# EAGLE schematic ImageProc_2.5 (EAGLE 6.2)
AUTHOR: Ryan Julian (ryanjulian@berkeley.edu); REVISION: A; YEAR: 2012

## Sheet 1 of 5: Power
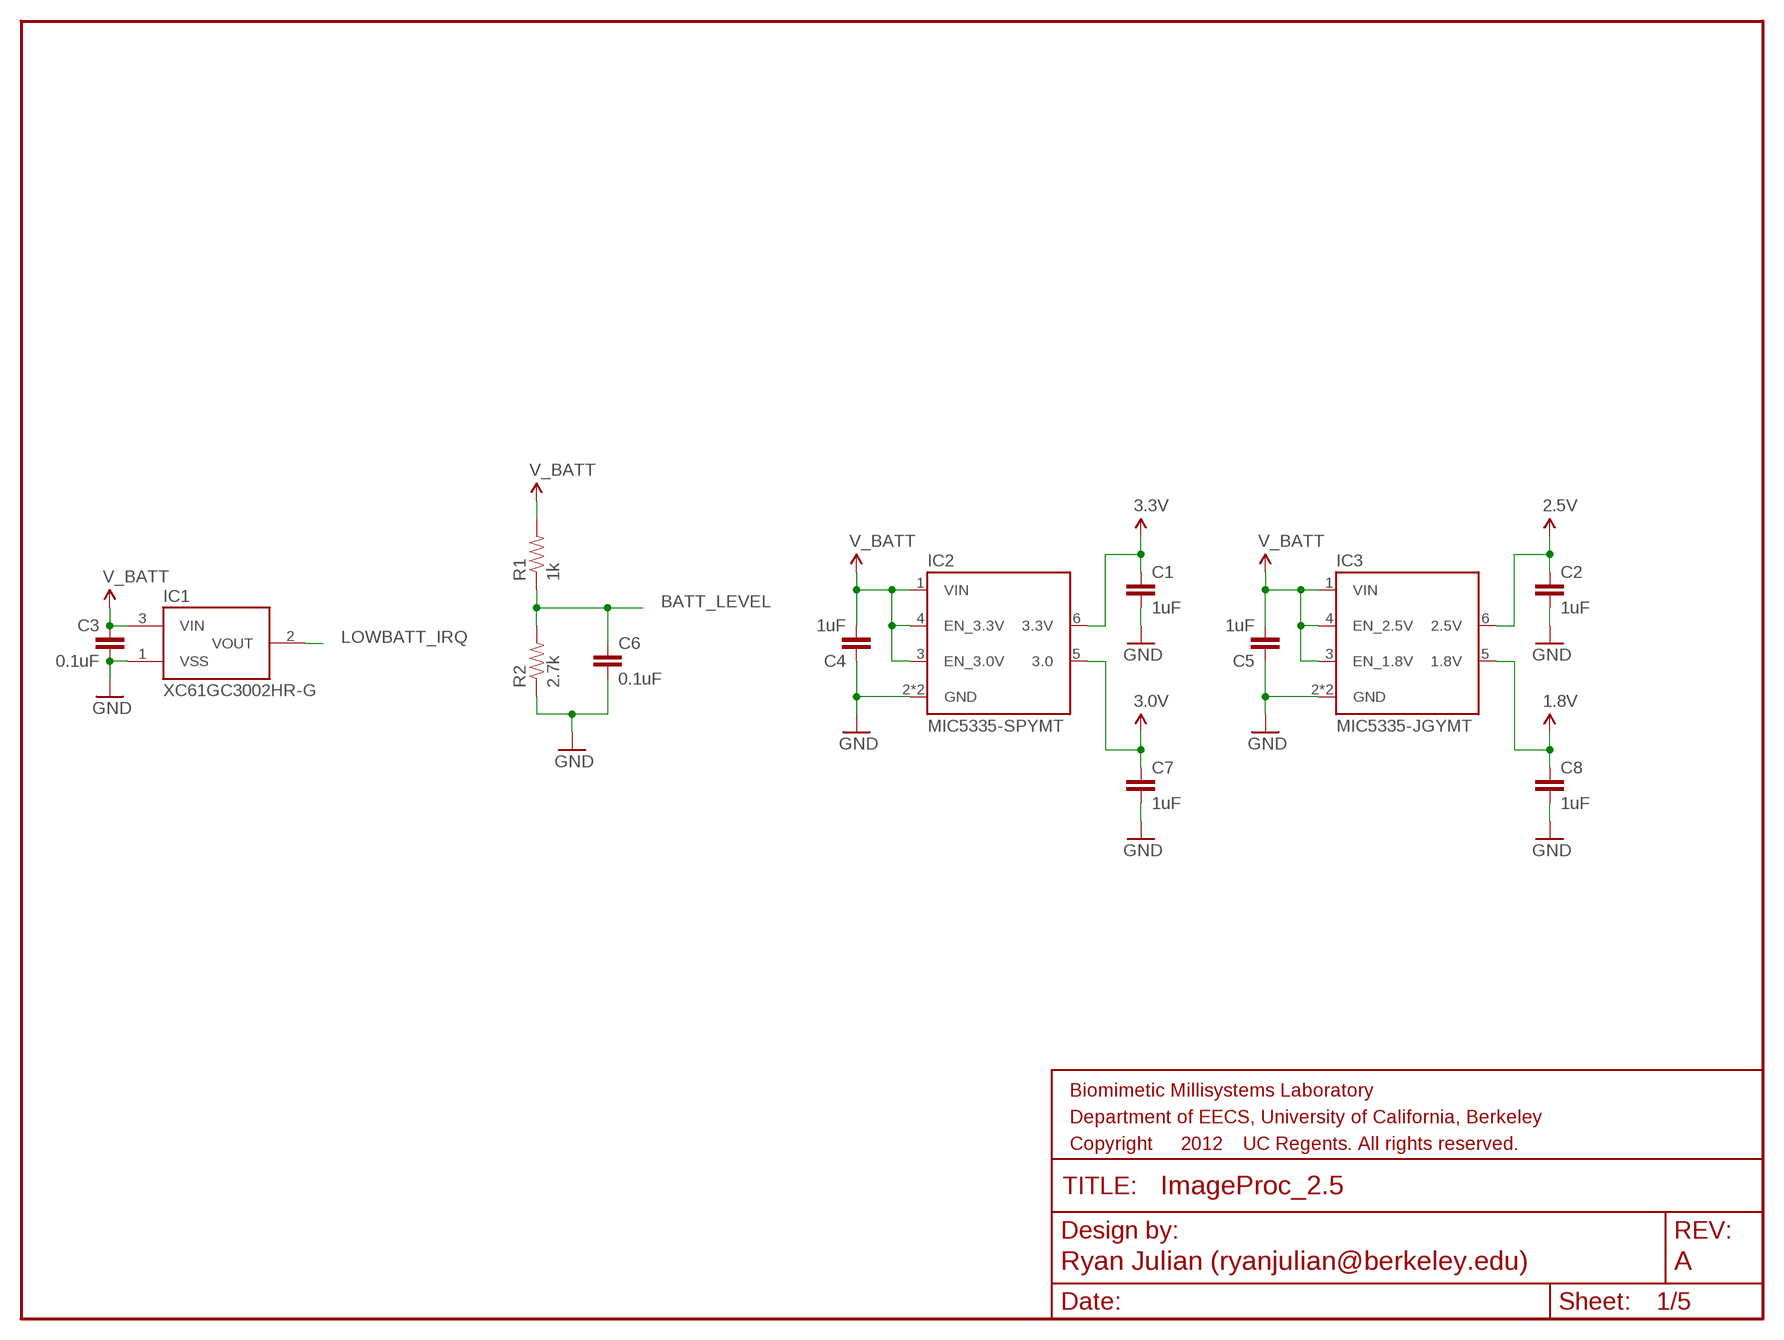
[diagram p0: schematic, sheet 1]
FRAME6 (FRAME-LETTER): YEAR: 2012

### Parts
C1  1uF  CAP0402-CAP  [0402-CAP]
C2  1uF  CAP0402-CAP  [0402-CAP]
C3  0.1uF  CAP0402-CAP  [0402-CAP]
C4  1uF  CAP0402-CAP  [0402-CAP]
C5  1uF  CAP0402-CAP  [0402-CAP]
C6  0.1uF  CAP0402-CAP  [0402-CAP]
C7  1uF  CAP0402-CAP  [0402-CAP]
C8  1uF  CAP0402-CAP  [0402-CAP]
IC1  XC61GC3002HR-G  [USP-3]
IC2  MIC5335-SPYMT  [MLF-6]
IC3  MIC5335-JGYMT  [MLF-6]
R1  1k  RESISTOR0402-RES  [0402-RES]
R2  2.7k  RESISTOR0402-RES  [0402-RES]

### Nets
1.8V: C8.1 IC3.5(1.8V) ; also sheet 5
2.5V: C2.1 IC3.6(2.5V) ; also sheet 5
3.0V: C7.1 IC2.5(3.0)
3.3V: C1.1 IC2.6(3.3V) ; also sheet 2,3,4,5
BATT_LEVEL: C6.1 R1.1 R2.2 ; also sheet 2
GND: C1.2 C2.2 C3.2 C4.1 C5.1 C6.2 C7.2 C8.2 IC1.1(VSS) IC2.2(GND) IC2.EPAD(GND) IC3.2(GND) IC3.EPAD(GND) R2.1 ; also sheet 2,3,4,5
LOWBATT_IRQ: IC1.2(VOUT) ; also sheet 2
V_BATT: C3.1 C4.2 C5.2 IC1.3(VIN) IC2.1(VIN) IC2.3(EN_3.0V) IC2.4(EN_3.3V) IC3.1(VIN) IC3.3(EN_1.8V) IC3.4(EN_2.5V) R1.2 ; also sheet 4,5

## Sheet 2 of 5: Microcontroller
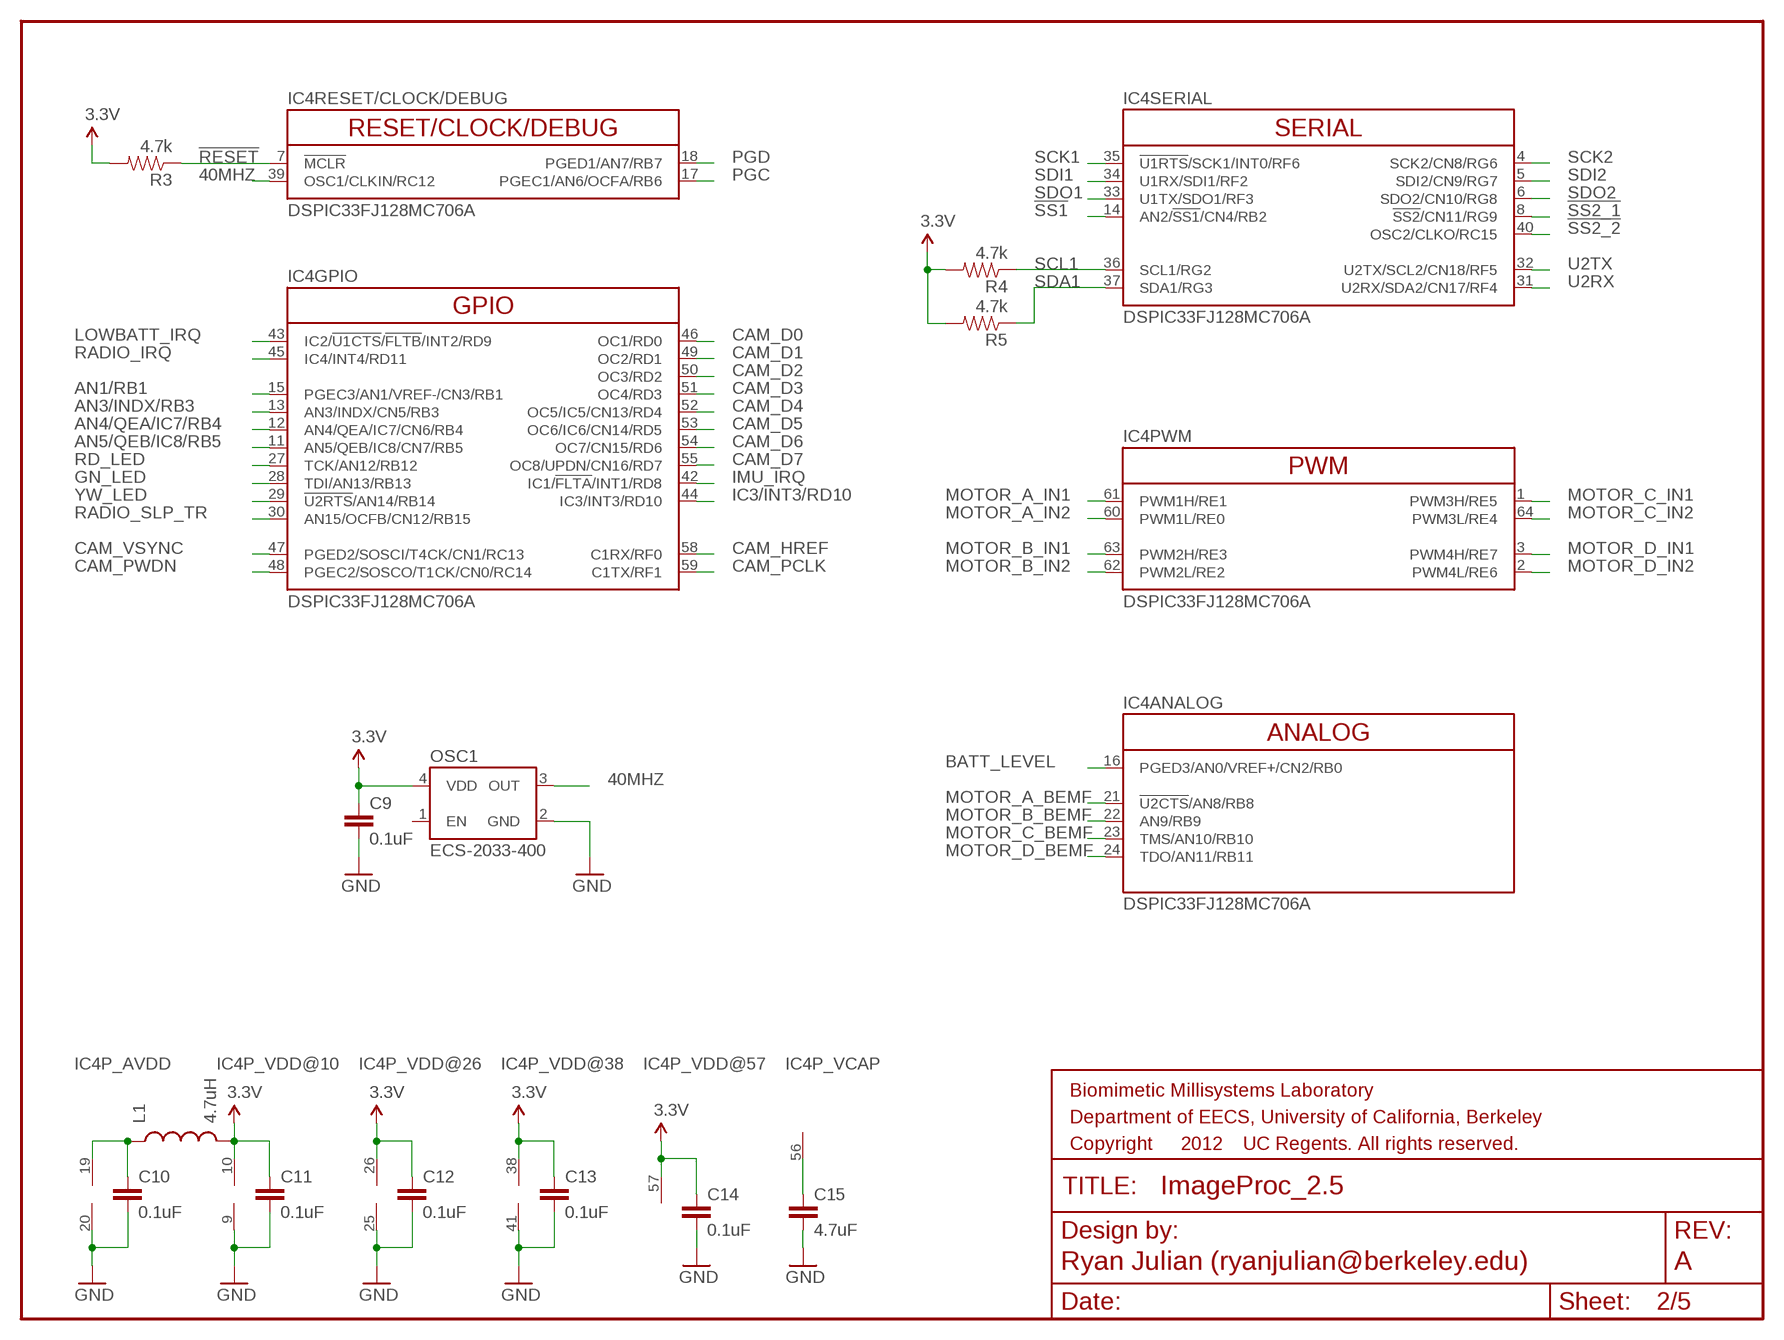
[diagram p1: schematic, sheet 2]

### Parts
C9  0.1uF  CAP0402-CAP  [0402-CAP]
C10  0.1uF  CAP0402-CAP  [0402-CAP]
C11  0.1uF  CAP0402-CAP  [0402-CAP]
C12  0.1uF  CAP0402-CAP  [0402-CAP]
C13  0.1uF  CAP0402-CAP  [0402-CAP]
C14  0.1uF  CAP0402-CAP  [0402-CAP]
C15  4.7uF  CAP0603-CAP  [0603-CAP]
IC4  DSPIC33FJ128MC706A  [TQFP-64]
L1  4.7uH  INDUCTOR0603  [0603]
OSC1  ECS-2033-400  [OSCILLATOR-SMD]
R3  4.7k  RESISTOR0402-RES  [0402-RES]
R4  4.7k  RESISTOR0402-RES  [0402-RES]
R5  4.7k  RESISTOR0402-RES  [0402-RES]

### Nets
3.3V: C9.1 C11.1 C12.1 C13.1 C14.1 IC4.10(P_VDD@10:V+) IC4.26(P_VDD@26:V+) IC4.38(P_VDD@38:V+) IC4.57(P_VDD@57:V+) L1.2 OSC1.4(VDD) R3.2 R4.2 R5.2 ; also sheet 1,3,4,5
40MHZ: IC4.39(RESET/CLOCK/DEBUG:OSC1/CLKIN/RC12) OSC1.3(OUT) ; also sheet 5
!RESET: IC4.7(RESET/CLOCK/DEBUG:!MCLR) R3.1 ; also sheet 3,5
!SS1: IC4.14(SERIAL:AN2/!SS1!/CN4/RB2) ; also sheet 3
!SS2_1: IC4.8(SERIAL:!SS2!/CN11/RG9) ; also sheet 5
!SS2_2: IC4.40(SERIAL:OSC2/CLKO/RC15) ; also sheet 5
AN1/RB1: IC4.15(GPIO:PGEC3/AN1/VREF-/CN3/RB1) ; also sheet 5
AN3/INDX/RB3: IC4.13(GPIO:AN3/INDX/CN5/RB3) ; also sheet 5
AN4/QEA/IC7/RB4: IC4.12(GPIO:AN4/QEA/IC7/CN6/RB4) ; also sheet 5
AN5/QEB/IC8/RB5: IC4.11(GPIO:AN5/QEB/IC8/CN7/RB5) ; also sheet 5
BATT_LEVEL: IC4.16(ANALOG:PGED3/AN0/VREF+/CN2/RB0) ; also sheet 1
CAM_D0: IC4.46(GPIO:OC1/RD0) ; also sheet 5
CAM_D1: IC4.49(GPIO:OC2/RD1) ; also sheet 5
CAM_D2: IC4.50(GPIO:OC3/RD2) ; also sheet 5
CAM_D3: IC4.51(GPIO:OC4/RD3) ; also sheet 5
CAM_D4: IC4.52(GPIO:OC5/IC5/CN13/RD4) ; also sheet 5
CAM_D5: IC4.53(GPIO:OC6/IC6/CN14/RD5) ; also sheet 5
CAM_D6: IC4.54(GPIO:OC7/CN15/RD6) ; also sheet 5
CAM_D7: IC4.55(GPIO:OC8/UPDN/CN16/RD7) ; also sheet 5
CAM_HREF: IC4.58(GPIO:C1RX/RF0) ; also sheet 5
CAM_PCLK: IC4.59(GPIO:C1TX/RF1) ; also sheet 5
CAM_PWDN: IC4.48(GPIO:PGEC2/SOSCO/T1CK/CN0/RC14) ; also sheet 5
CAM_VSYNC: IC4.47(GPIO:PGED2/SOSCI/T4CK/CN1/RC13) ; also sheet 5
GN_LED: IC4.28(GPIO:TDI/AN13/RB13) ; also sheet 5
GND: C9.2 C10.2 C11.2 C12.2 C13.2 C14.2 C15.2 IC4.9(P_VDD@10:V-) IC4.20(P_AVDD:V-) IC4.25(P_VDD@26:V-) IC4.41(P_VDD@38:V-) OSC1.2(GND) ; also sheet 1,3,4,5
IC3/INT3/RD10: IC4.44(GPIO:IC3/INT3/RD10) ; also sheet 5
IMU_IRQ: IC4.42(GPIO:IC1/!FLTA!/INT1/RD8) ; also sheet 5
LOWBATT_IRQ: IC4.43(GPIO:IC2/!U1CTS!/!FLTB!/INT2/RD9) ; also sheet 1
MOTOR_A_BEMF: IC4.21(ANALOG:!U2CTS!/AN8/RB8) ; also sheet 4
MOTOR_A_IN1: IC4.61(PWM:PWM1H/RE1) ; also sheet 4
MOTOR_A_IN2: IC4.60(PWM:PWM1L/RE0) ; also sheet 4
MOTOR_B_BEMF: IC4.22(ANALOG:AN9/RB9) ; also sheet 4
MOTOR_B_IN1: IC4.63(PWM:PWM2H/RE3) ; also sheet 4
MOTOR_B_IN2: IC4.62(PWM:PWM2L/RE2) ; also sheet 4
MOTOR_C_BEMF: IC4.23(ANALOG:TMS/AN10/RB10) ; also sheet 4
MOTOR_C_IN1: IC4.1(PWM:PWM3H/RE5) ; also sheet 4
MOTOR_C_IN2: IC4.64(PWM:PWM3L/RE4) ; also sheet 4
MOTOR_D_BEMF: IC4.24(ANALOG:TDO/AN11/RB11) ; also sheet 4
MOTOR_D_IN1: IC4.3(PWM:PWM4H/RE7) ; also sheet 4
MOTOR_D_IN2: IC4.2(PWM:PWM4L/RE6) ; also sheet 4
N$21: C10.1 IC4.19(P_AVDD:V+) L1.1
N$28: C15.1 IC4.56(P_VCAP:V+)
PGC: IC4.17(RESET/CLOCK/DEBUG:PGEC1/AN6/OCFA/RB6) ; also sheet 5
PGD: IC4.18(RESET/CLOCK/DEBUG:PGED1/AN7/RB7) ; also sheet 5
RADIO_IRQ: IC4.45(GPIO:IC4/INT4/RD11) ; also sheet 3
RADIO_SLP_TR: IC4.30(GPIO:AN15/OCFB/CN12/RB15) ; also sheet 3
RD_LED: IC4.27(GPIO:TCK/AN12/RB12) ; also sheet 5
SCK1: IC4.35(SERIAL:!U1RTS!/SCK1/INT0/RF6) ; also sheet 3
SCK2: IC4.4(SERIAL:SCK2/CN8/RG6) ; also sheet 5
SCL1: IC4.36(SERIAL:SCL1/RG2) R4.1 ; also sheet 5
SDA1: IC4.37(SERIAL:SDA1/RG3) R5.1 ; also sheet 5
SDI1: IC4.34(SERIAL:U1RX/SDI1/RF2) ; also sheet 3
SDI2: IC4.5(SERIAL:SDI2/CN9/RG7) ; also sheet 5
SDO1: IC4.33(SERIAL:U1TX/SDO1/RF3) ; also sheet 3
SDO2: IC4.6(SERIAL:SDO2/CN10/RG8) ; also sheet 5
U2RX: IC4.31(SERIAL:U2RX/SDA2/CN17/RF4) ; also sheet 5
U2TX: IC4.32(SERIAL:U2TX/SCL2/CN18/RF5) ; also sheet 5
YW_LED: IC4.29(GPIO:!U2RTS!/AN14/RB14) ; also sheet 5
Unconnected: OSC1.1(EN)

## Sheet 3 of 5: Radio
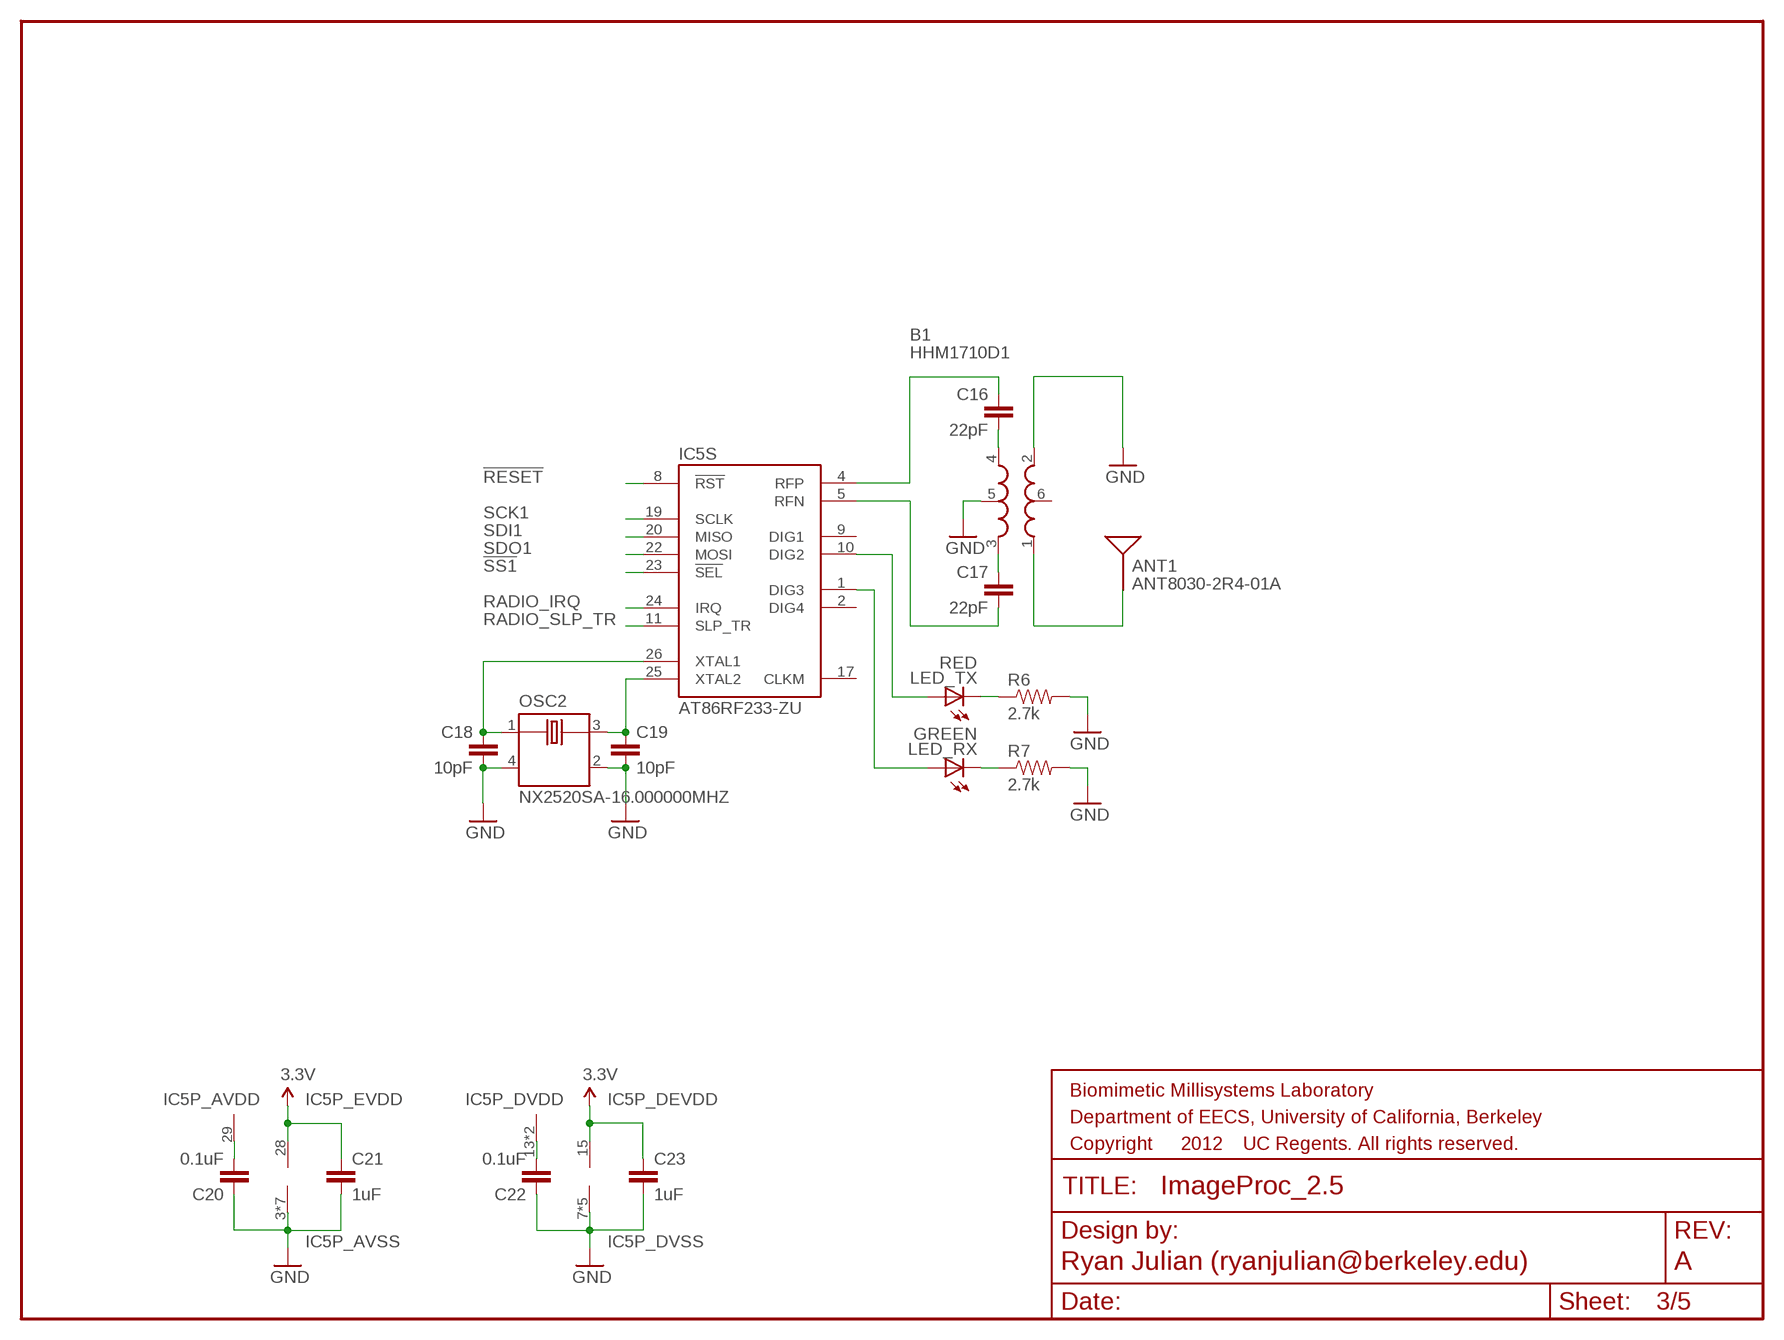
[diagram p2: schematic, sheet 3]

### Parts
ANT1  ANT8030-2R4-01A  [ANT8030-2R4-01A]
B1  HHM1710D1  [0603-BALUN]
C16  22pF  CAP0402-CAP  [0402-CAP]
C17  22pF  CAP0402-CAP  [0402-CAP]
C18  10pF  CAP0402-CAP  [0402-CAP]
C19  10pF  CAP0402-CAP  [0402-CAP]
C20  0.1uF  CAP0402-CAP  [0402-CAP]
C21  1uF  CAP0402-CAP  [0402-CAP]
C22  0.1uF  CAP0402-CAP  [0402-CAP]
C23  1uF  CAP0402-CAP  [0402-CAP]
IC5  AT86RF233-ZU  [VQFN-32QN2]
LED_RX  GREEN  LED0603  [LED-0603]
LED_TX  RED  LED0603  [LED-0603]
OSC2  NX2520SA-16.000000MHZ  [CRYSTAL-SMD]
R6  2.7k  RESISTOR0402-RES  [0402-RES]
R7  2.7k  RESISTOR0402-RES  [0402-RES]

### Nets
3.3V: C21.1 C23.1 IC5.15(P_DEVDD:V+) IC5.28(P_EVDD:V+) ; also sheet 1,2,4,5
!RESET: IC5.8(S:!RST) ; also sheet 2,5
!SS1: IC5.23(S:!SEL) ; also sheet 2
GND: B1.2(RFGND) B1.5(GND) C18.2 C19.2 C20.1 C21.2 C22.1 C23.2 IC5.3(P_AVSS:V-) IC5.6(P_AVSS:V-) IC5.7(P_DVSS:V-) IC5.12(P_DVSS:V-) IC5.16(P_DVSS:V-) IC5.18(P_DVSS:V-) IC5.21(P_DVSS:V-) IC5.27(P_AVSS:V-) IC5.30(P_AVSS:V-) IC5.31(P_AVSS:V-) IC5.32(P_AVSS:V-) IC5.PAD(P_AVSS:V-) OSC2.2(GND) OSC2.4(GND) R6.2 R7.2 ; also sheet 1,2,4,5
N$1: C22.2 IC5.13(P_DVDD:V+) IC5.14(P_DVDD:V+)
N$3: C20.2 IC5.29(P_AVDD:V+)
N$4: ANT1.A(SIGNAL) B1.1(UNBAL)
N$5: LED_TX.C R6.1
N$6: C16.1 IC5.4(S:RFP)
N$7: C17.2 IC5.5(S:RFN)
N$8: C19.1 IC5.25(S:XTAL2) OSC2.3(OUT/IN)
N$9: C18.1 IC5.26(S:XTAL1) OSC2.1(IN/OUT)
N$10: B1.3(BAL3) C17.1
N$11: LED_RX.C R7.1
N$12: B1.4(BAL4) C16.2
N$13: IC5.1(S:DIG3) LED_RX.A
N$14: IC5.10(S:DIG2) LED_TX.A
RADIO_IRQ: IC5.24(S:IRQ) ; also sheet 2
RADIO_SLP_TR: IC5.11(S:SLP_TR) ; also sheet 2
SCK1: IC5.19(S:SCLK) ; also sheet 2
SDI1: IC5.20(S:MISO) ; also sheet 2
SDO1: IC5.22(S:MOSI) ; also sheet 2
Unconnected: B1.6(NC) IC5.2(S:DIG4) IC5.9(S:DIG1) IC5.17(S:CLKM)

## Sheet 4 of 5: Motor Control
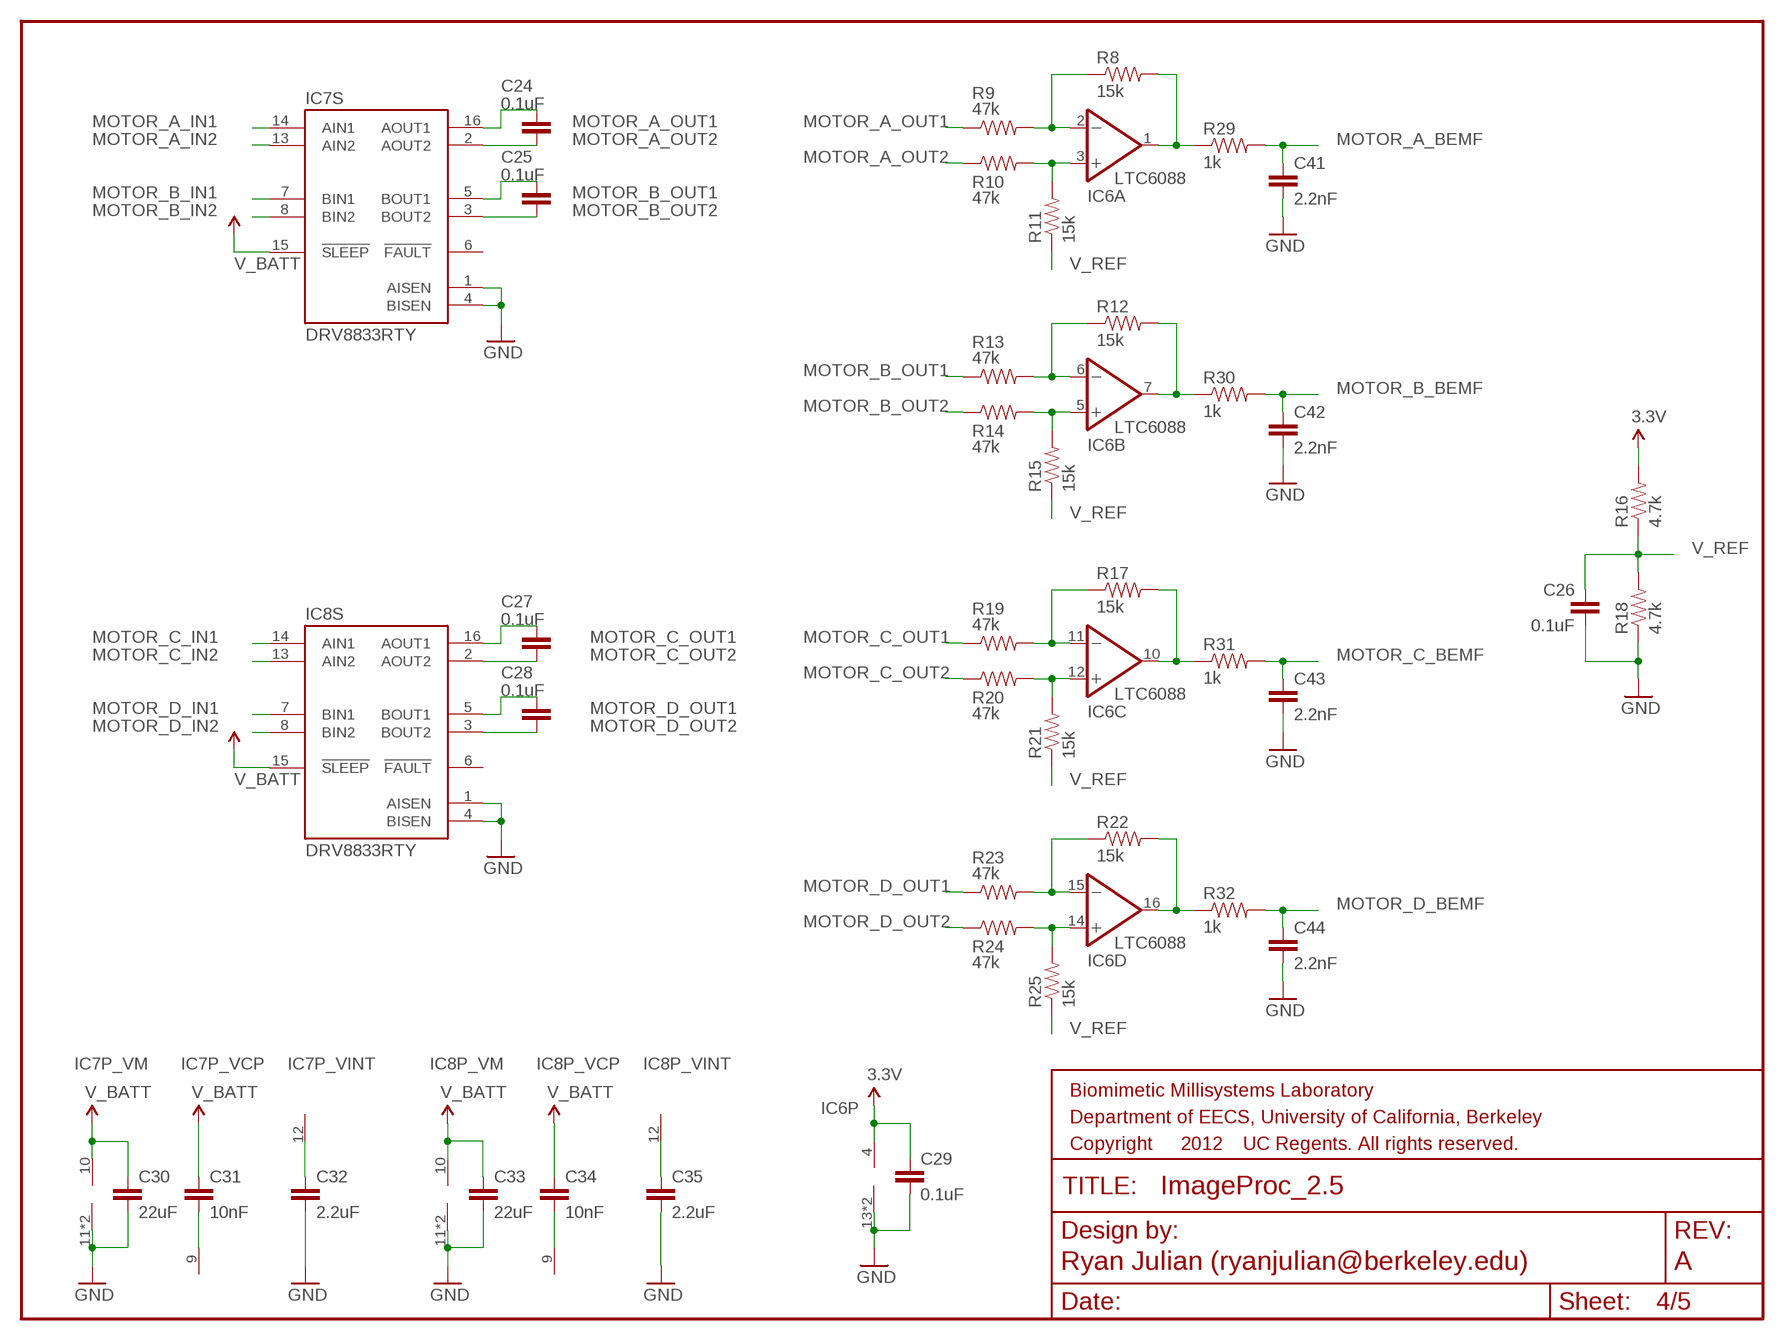
[diagram p3: schematic, sheet 4]

### Parts
C24  0.1uF  CAP0402-CAP  [0402-CAP]
C25  0.1uF  CAP0402-CAP  [0402-CAP]
C26  0.1uF  CAP0402-CAP  [0402-CAP]
C27  0.1uF  CAP0402-CAP  [0402-CAP]
C28  0.1uF  CAP0402-CAP  [0402-CAP]
C29  0.1uF  CAP0402-CAP  [0402-CAP]
C30  22uF  CAP0603-CAP  [0603-CAP]
C31  10nF  CAP0402-CAP  [0402-CAP]
C32  2.2uF  CAP0402-CAP  [0402-CAP]
C33  22uF  CAP0603-CAP  [0603-CAP]
C34  10nF  CAP0402-CAP  [0402-CAP]
C35  2.2uF  CAP0402-CAP  [0402-CAP]
C41  2.2nF  CAP0402-CAP  [0402-CAP]
C42  2.2nF  CAP0402-CAP  [0402-CAP]
C43  2.2nF  CAP0402-CAP  [0402-CAP]
C44  2.2nF  CAP0402-CAP  [0402-CAP]
IC6  LTC6088  [DFN-16]
IC7  DRV8833RTY  [S-PWQFN-N16]
IC8  DRV8833RTY  [S-PWQFN-N16]
R8  15k  RESISTOR0402-RES  [0402-RES]
R9  47k  RESISTOR0402-RES  [0402-RES]
R10  47k  RESISTOR0402-RES  [0402-RES]
R11  15k  RESISTOR0402-RES  [0402-RES]
R12  15k  RESISTOR0402-RES  [0402-RES]
R13  47k  RESISTOR0402-RES  [0402-RES]
R14  47k  RESISTOR0402-RES  [0402-RES]
R15  15k  RESISTOR0402-RES  [0402-RES]
R16  4.7k  RESISTOR0402-RES  [0402-RES]
R17  15k  RESISTOR0402-RES  [0402-RES]
R18  4.7k  RESISTOR0402-RES  [0402-RES]
R19  47k  RESISTOR0402-RES  [0402-RES]
R20  47k  RESISTOR0402-RES  [0402-RES]
R21  15k  RESISTOR0402-RES  [0402-RES]
R22  15k  RESISTOR0402-RES  [0402-RES]
R23  47k  RESISTOR0402-RES  [0402-RES]
R24  47k  RESISTOR0402-RES  [0402-RES]
R25  15k  RESISTOR0402-RES  [0402-RES]
R29  1k  RESISTOR0402-RES  [0402-RES]
R30  1k  RESISTOR0402-RES  [0402-RES]
R31  1k  RESISTOR0402-RES  [0402-RES]
R32  1k  RESISTOR0402-RES  [0402-RES]

### Nets
3.3V: C29.1 IC6.4(P:V+) R16.2 ; also sheet 1,2,3,5
GND: C26.2 C29.2 C30.2 C32.2 C33.2 C35.2 C41.2 C42.2 C43.2 C44.2 IC6.13(P:V-) IC6.PAD(P:V-) IC7.1(S:AISEN) IC7.4(S:BISEN) IC7.11(P_VM:V-) IC7.PPAD(P_VM:V-) IC8.1(S:AISEN) IC8.4(S:BISEN) IC8.11(P_VM:V-) IC8.PPAD(P_VM:V-) R18.1 ; also sheet 1,2,3,5
MOTOR_A_BEMF: C41.1 R29.2 ; also sheet 2
MOTOR_A_IN1: IC7.14(S:AIN1) ; also sheet 2
MOTOR_A_IN2: IC7.13(S:AIN2) ; also sheet 2
MOTOR_A_OUT1: C24.1 IC7.16(S:AOUT1) R9.1 ; also sheet 5
MOTOR_A_OUT2: C24.2 IC7.2(S:AOUT2) R10.1 ; also sheet 5
MOTOR_B_BEMF: C42.1 R30.2 ; also sheet 2
MOTOR_B_IN1: IC7.7(S:BIN1) ; also sheet 2
MOTOR_B_IN2: IC7.8(S:BIN2) ; also sheet 2
MOTOR_B_OUT1: C25.1 IC7.5(S:BOUT1) R13.1 ; also sheet 5
MOTOR_B_OUT2: C25.2 IC7.3(S:BOUT2) R14.1 ; also sheet 5
MOTOR_C_BEMF: C43.1 R31.2 ; also sheet 2
MOTOR_C_IN1: IC8.14(S:AIN1) ; also sheet 2
MOTOR_C_IN2: IC8.13(S:AIN2) ; also sheet 2
MOTOR_C_OUT1: C27.1 IC8.16(S:AOUT1) R19.1 ; also sheet 5
MOTOR_C_OUT2: C27.2 IC8.2(S:AOUT2) R20.1 ; also sheet 5
MOTOR_D_BEMF: C44.1 R32.2 ; also sheet 2
MOTOR_D_IN1: IC8.7(S:BIN1) ; also sheet 2
MOTOR_D_IN2: IC8.8(S:BIN2) ; also sheet 2
MOTOR_D_OUT1: C28.1 IC8.5(S:BOUT1) R23.1 ; also sheet 5
MOTOR_D_OUT2: C28.2 IC8.3(S:BOUT2) R24.1 ; also sheet 5
N$2: C31.2 IC7.9(P_VCP:V+)
N$18: C32.1 IC7.12(P_VINT:V-)
N$19: C34.2 IC8.9(P_VCP:V+)
N$20: C35.1 IC8.12(P_VINT:V-)
N$22: IC6.6(B:-IN) R12.1 R13.2
N$23: IC6.5(B:+IN) R14.2 R15.2
N$24: IC6.11(C:-IN) R17.1 R19.2
N$25: IC6.12(C:+IN) R20.2 R21.2
N$26: IC6.15(D:-IN) R22.1 R23.2
N$27: IC6.14(D:+IN) R24.2 R25.2
N$30: IC6.2(A:-IN) R8.1 R9.2
N$31: IC6.3(A:+IN) R10.2 R11.2
N$34: IC6.16(D:OUT) R22.2 R32.1
N$35: IC6.10(C:OUT) R17.2 R31.1
N$36: IC6.1(A:OUT) R8.2 R29.1
N$37: IC6.7(B:OUT) R12.2 R30.1
V_BATT: C30.1 C31.1 C33.1 C34.1 IC7.10(P_VM:V+) IC7.15(S:!SLEEP) IC8.10(P_VM:V+) IC8.15(S:!SLEEP) ; also sheet 1,5
V_REF: C26.1 R11.1 R15.1 R16.1 R18.2 R21.1 R25.1
Unconnected: IC7.6(S:!FAULT) IC8.6(S:!FAULT)

## Sheet 5 of 5: Connectors and Peripherals
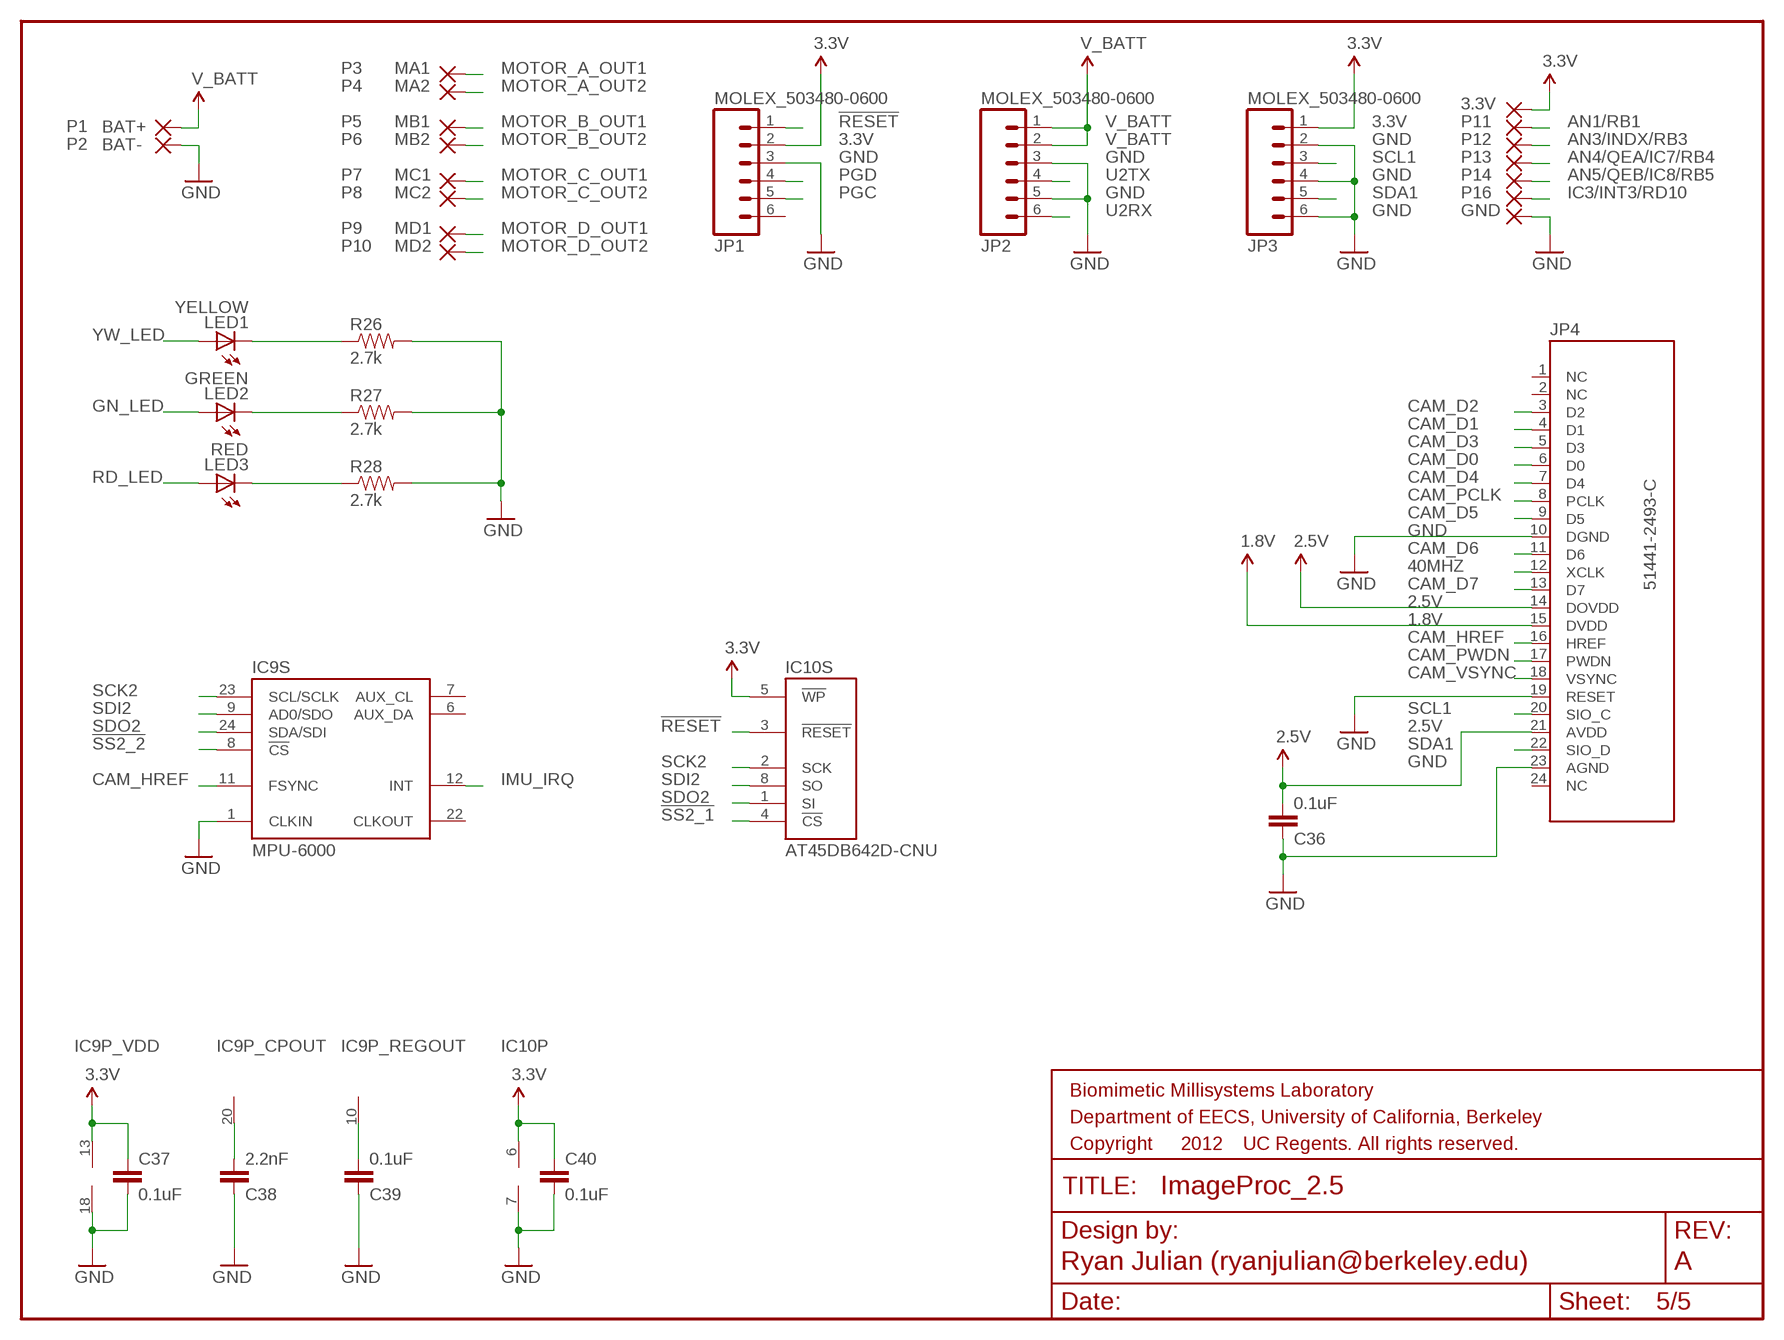
[diagram p4: schematic, sheet 5]

### Parts
3.3V  EXT5  SMD2  [SMD1,27-2,54]
C36  0.1uF  CAP0402-CAP  [0402-CAP]
C37  0.1uF  CAP0402-CAP  [0402-CAP]
C38  2.2nF  CAP0402-CAP  [0402-CAP]
C39  0.1uF  CAP0402-CAP  [0402-CAP]
C40  0.1uF  CAP0402-CAP  [0402-CAP]
GND  EXT5  SMD2  [SMD1,27-2,54]
IC9  MPU-6000  [QFN-24]
IC10  AT45DB642D-CNU  [CASON-8]
JP1  MOLEX_503480-0600  [MOLEX_503480-0600]
JP2  MOLEX_503480-0600  [MOLEX_503480-0600]
JP3  MOLEX_503480-0600  [MOLEX_503480-0600]
JP4  51441-2493-C  OV7660FSL_CON  [MOLEX_52740-2490]
LED1  YELLOW  LED0603  [LED-0603]
LED2  GREEN  LED0603  [LED-0603]
LED3  RED  LED0603  [LED-0603]
P1  BAT+  SMD2  [SMD1,27-2,54]
P2  BAT-  SMD2  [SMD1,27-2,54]
P3  MA1  SMD2  [SMD1,27-2,54]
P4  MA2  SMD2  [SMD1,27-2,54]
P5  MB1  SMD2  [SMD1,27-2,54]
P6  MB2  SMD2  [SMD1,27-2,54]
P7  MC1  SMD2  [SMD1,27-2,54]
P8  MC2  SMD2  [SMD1,27-2,54]
P9  MD1  SMD2  [SMD1,27-2,54]
P10  MD2  SMD2  [SMD1,27-2,54]
P11  EXT1  SMD2  [SMD1,27-2,54]
P12  EXT2  SMD2  [SMD1,27-2,54]
P13  EXT3  SMD2  [SMD1,27-2,54]
P14  EXT4  SMD2  [SMD1,27-2,54]
P16  EXT5  SMD2  [SMD1,27-2,54]
R26  2.7k  RESISTOR0402-RES  [0402-RES]
R27  2.7k  RESISTOR0402-RES  [0402-RES]
R28  2.7k  RESISTOR0402-RES  [0402-RES]

### Nets
1.8V: JP4.15(DVDD) ; also sheet 1
2.5V: C36.2 JP4.14(DOVDD) JP4.21(AVDD) ; also sheet 1
3.3V: 3.3V.1(P) C37.1 C40.1 IC9.13(P_VDD:V+) IC10.5(S:!WP) IC10.6(P:V+) JP1.2 JP3.1 ; also sheet 1,2,3,4
40MHZ: JP4.12(XCLK) ; also sheet 2
!RESET: IC10.3(S:!RESET) JP1.1 ; also sheet 2,3
!SS2_1: IC10.4(S:!CS) ; also sheet 2
!SS2_2: IC9.8(S:!CS) ; also sheet 2
AN1/RB1: P11.1(P) ; also sheet 2
AN3/INDX/RB3: P12.1(P) ; also sheet 2
AN4/QEA/IC7/RB4: P13.1(P) ; also sheet 2
AN5/QEB/IC8/RB5: P14.1(P) ; also sheet 2
CAM_D0: JP4.6(D0) ; also sheet 2
CAM_D1: JP4.4(D1) ; also sheet 2
CAM_D2: JP4.3(D2) ; also sheet 2
CAM_D3: JP4.5(D3) ; also sheet 2
CAM_D4: JP4.7(D4) ; also sheet 2
CAM_D5: JP4.9(D5) ; also sheet 2
CAM_D6: JP4.11(D6) ; also sheet 2
CAM_D7: JP4.13(D7) ; also sheet 2
CAM_HREF: IC9.11(S:FSYNC) JP4.16(HREF) ; also sheet 2
CAM_PCLK: JP4.8(PCLK) ; also sheet 2
CAM_PWDN: JP4.17(PWDN) ; also sheet 2
CAM_VSYNC: JP4.18(VSYNC) ; also sheet 2
GN_LED: LED2.A ; also sheet 2
GND: C36.1 C37.2 C38.1 C39.1 C40.2 GND.1(P) IC9.1(S:CLKIN) IC9.18(P_VDD:V-) IC10.7(P:V-) JP1.3 JP2.3 JP2.5 JP3.2 JP3.4 JP3.6 JP4.10(DGND) JP4.19(RESET) JP4.23(AGND) P2.1(P) R26.2 R27.2 R28.2 ; also sheet 1,2,3,4
IC3/INT3/RD10: P16.1(P) ; also sheet 2
IMU_IRQ: IC9.12(S:INT) ; also sheet 2
MOTOR_A_OUT1: P3.1(P) ; also sheet 4
MOTOR_A_OUT2: P4.1(P) ; also sheet 4
MOTOR_B_OUT1: P5.1(P) ; also sheet 4
MOTOR_B_OUT2: P6.1(P) ; also sheet 4
MOTOR_C_OUT1: P7.1(P) ; also sheet 4
MOTOR_C_OUT2: P8.1(P) ; also sheet 4
MOTOR_D_OUT1: P9.1(P) ; also sheet 4
MOTOR_D_OUT2: P10.1(P) ; also sheet 4
N$15: LED1.C R26.1
N$16: LED2.C R27.1
N$17: LED3.C R28.1
N$29: C38.2 IC9.20(P_CPOUT:V-)
N$32: C39.2 IC9.10(P_REGOUT:V-)
PGC: JP1.5 ; also sheet 2
PGD: JP1.4 ; also sheet 2
RD_LED: LED3.A ; also sheet 2
SCK2: IC9.23(S:SCL/SCLK) IC10.2(S:SCK) ; also sheet 2
SCL1: JP3.3 JP4.20(SIO_C) ; also sheet 2
SDA1: JP3.5 JP4.22(SIO_D) ; also sheet 2
SDI2: IC9.9(S:AD0/SDO) IC10.8(S:SO) ; also sheet 2
SDO2: IC9.24(S:SDA/SDI) IC10.1(S:SI) ; also sheet 2
U2RX: JP2.6 ; also sheet 2
U2TX: JP2.4 ; also sheet 2
V_BATT: JP2.1 JP2.2 P1.1(P) ; also sheet 1,4
YW_LED: LED1.A ; also sheet 2
Unconnected: IC9.6(S:AUX_DA) IC9.7(S:AUX_CL) IC9.22(S:CLKOUT) JP1.6 JP4.1(NC) JP4.2(NC) JP4.24(NC)

## Library data of the parts
3.3V GND P1-P14 P16 = wirepad:SMD2: SMD PAD
ANT1 = biomimetic:ANT8030-2R4-01A
B1 = biomimetic:HHM1710D1
C1-C14 C26 C29 C30 C33 C36 C40-C44 = biomimetic:CAP: Capacitor Standard 0603 ceramic capacitor, and 0.1" leaded capacitor.
C15 = biomimetic:CAP: Capacitor Standard 0603 ceramic capacitor, and 0.1" leaded capacitor.; COMMENT: ESR < 5 Ohm; TECHNOLOGY: CERAMIC; VOLTAGE: 16V
C16 C17 = biomimetic:CAP: Capacitor Standard 0603 ceramic capacitor, and 0.1" leaded capacitor.; DIELECTRIC: C0G; TECHNOLOGY: CERAMIC; TOLERANCE: 5%; VOLTAGE: 50V
C18 C19 = biomimetic:CAP: Capacitor Standard 0603 ceramic capacitor, and 0.1" leaded capacitor.; DIELECTRIC: C0G; TECHNOLOGY: CERAMIC; TOLERANCE: 10%; VOLTAGE: 50V
C20 C22 = biomimetic:CAP: Capacitor Standard 0603 ceramic capacitor, and 0.1" leaded capacitor.; DIELECTRIC: X7R; TECHNOLOGY: CERAMIC; TOLERANCE: 10%; VOLTAGE: 16V
C21 C23 = biomimetic:CAP: Capacitor Standard 0603 ceramic capacitor, and 0.1" leaded capacitor.; DIELECTRIC: X5R; TECHNOLOGY: CERAMIC; TOLERANCE: 10%; VOLTAGE: 16V
C24 C25 C27 C28 = biomimetic:CAP: Capacitor Standard 0603 ceramic capacitor, and 0.1" leaded capacitor.; TECHNOLOGY: CERAMIC; VOLTAGE: 10V
C31 C34 = biomimetic:CAP: Capacitor Standard 0603 ceramic capacitor, and 0.1" leaded capacitor.; DIELECTRIC: X7R; TECHNOLOGY: CERAMIC; VOLTAGE: 16V
C32 C35 = biomimetic:CAP: Capacitor Standard 0603 ceramic capacitor, and 0.1" leaded capacitor.; TECHNOLOGY: CERAMIC; VOLTAGE: 6.3V
C37 = biomimetic:CAP: Capacitor Standard 0603 ceramic capacitor, and 0.1" leaded capacitor.; DIELECTRIC: X7R; TECHNOLOGY: CERAMIC; TOLERANCE: 10%; VOLTAGE: 4V
C38 = biomimetic:CAP: Capacitor Standard 0603 ceramic capacitor, and 0.1" leaded capacitor.; DIELECTRIC: X7R; TECHNOLOGY: CERAMIC; TOLERANCE: 10%; VOLTAGE: 50V
C39 = biomimetic:CAP: Capacitor Standard 0603 ceramic capacitor, and 0.1" leaded capacitor.; DIELECTRIC: X7R; TECHNOLOGY: CERAMIC; TOLERANCE: 10%; VOLTAGE: 2V
IC1 = biomimetic:XC61GC3002HR: Torex XC61GC3002HR-G 3.0V voltage detector. Digi-Key P/N: 893-1046-6-ND
IC2 = biomimetic:MIC5335-SPYMT: Micrel MIC5335 150mA dual (3.3V/3.0V) voltage regulator. Digi-Key P/N: 576-1949-6-ND
IC3 = biomimetic:MIC5335-JGYMT: Micrel MIC5335 150mA dual (2.5V/1.8V) voltage regulator Digi-Key P/N: 576-3589-6-ND
IC4 = biomimetic:DSPIC33FJ128MC706A
IC5 = biomimetic:AT86RF233
IC6 = biomimetic:LTC6088: 14MHz, Rail-to-Rail Output, 12nV/Hz, 1.1mA Op Amp Source: http://cds.linear.com/docs/Datasheet/60878fb.pdf Digi-Key P/N: LTC6088HDHC#PBF-ND
IC7 IC8 = biomimetic:DRV8833: TI DRV8833 1.5A Dual H-Bridge Motor Driver IC Digi-Key P/N: 296-29513-6-ND
IC9 = biomimetic:MPU-6000: MPU-6000 3-axis gyro + 3-axis accelerometer, SPI/I2C interface with auxiliary I2C interface for magnetometer
IC10 = biomimetic:AT45DB642D
JP1-JP3 = biomimetic:MOLEX_503480-0600
JP4 = biomimetic:OV7660FSL_CON
L1 = biomimetic:INDUCTOR: Inductors Basic Inductor/Choke - 0603 and 1206. Footprints are not proven and vary greatly between part numbers.
LED1-LED3 LED_RX LED_TX = biomimetic:LED: LEDs Standard schematic elements and footprints for 5mm, 3mm, 1206, and 0603 sized LEDs. 5mm - Spark Fun Electronics SKU : COM-00529 (and others)
OSC1 = biomimetic:ECS-2033-400: ECS 3.3V 40MHz oscillator Digi-Key P/N: XC1437DKR-ND
OSC2 = biomimetic:NX2520SA-16.000000MHZ: 644-1059-6-ND
R1-R7 R26-R32 = biomimetic:RESISTOR: Resistor Basic schematic elements and footprints for 0603, 1206, and PTH resistors.
R8-R25 = biomimetic:RESISTOR: Resistor Basic schematic elements and footprints for 0603, 1206, and PTH resistors.; TOLERANCE: 1%